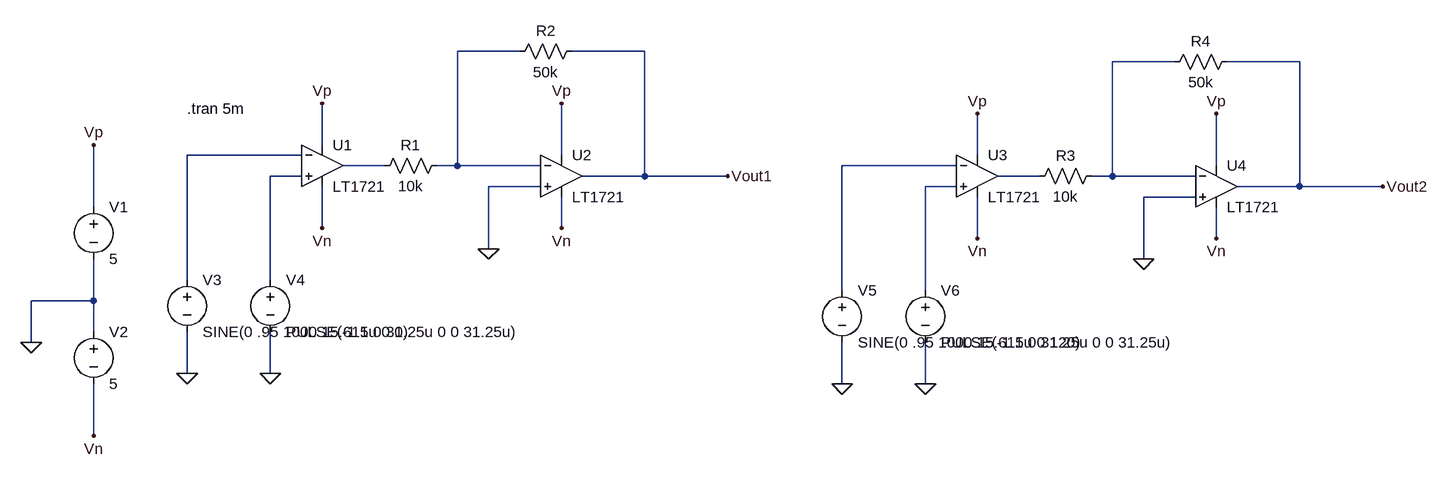
[diagram p0: schematic SPWM Experiment.asc]
SPWM Experiment.asc, the LTspice schematic file:
Version 4
SHEET 1 2196 680
WIRE 784 -176 688 -176
WIRE 976 -176 864 -176
WIRE 1792 -160 1696 -160
WIRE 1984 -160 1872 -160
WIRE 480 -32 480 -96
WIRE 448 -16 272 -16
WIRE 848 -16 848 -96
WIRE 1488 -16 1488 -80
WIRE 576 0 512 0
WIRE 688 0 688 -176
WIRE 688 0 656 0
WIRE 816 0 688 0
WIRE 1456 0 1280 0
WIRE 1856 0 1856 -80
WIRE 448 16 400 16
WIRE 976 16 976 -176
WIRE 976 16 880 16
WIRE 1104 16 976 16
WIRE 1584 16 1520 16
WIRE 1696 16 1696 -160
WIRE 1696 16 1664 16
WIRE 1824 16 1696 16
WIRE 816 32 736 32
WIRE 1456 32 1408 32
WIRE 1984 32 1984 -160
WIRE 1984 32 1888 32
WIRE 2112 32 1984 32
WIRE 1824 48 1744 48
WIRE 128 64 128 -32
WIRE 480 96 480 32
WIRE 848 96 848 48
WIRE 1488 112 1488 48
WIRE 1856 112 1856 64
WIRE 736 128 736 32
WIRE 1744 144 1744 48
WIRE 272 176 272 -16
WIRE 400 176 400 16
WIRE 1280 192 1280 0
WIRE 1408 192 1408 32
WIRE 128 208 128 144
WIRE 128 208 32 208
WIRE 128 256 128 208
WIRE 32 272 32 208
WIRE 272 320 272 256
WIRE 400 320 400 256
WIRE 1280 336 1280 272
WIRE 1408 336 1408 272
WIRE 128 416 128 336
FLAG 32 272 0
FLAG 128 -32 Vp
FLAG 128 416 Vn
FLAG 272 320 0
FLAG 400 320 0
FLAG 480 -96 Vp
FLAG 480 96 Vn
FLAG 848 -96 Vp
FLAG 848 96 Vn
FLAG 1104 16 Vout1
FLAG 736 128 0
FLAG 1280 336 0
FLAG 1408 336 0
FLAG 1488 -80 Vp
FLAG 1488 112 Vn
FLAG 1856 -80 Vp
FLAG 1856 112 Vn
FLAG 2112 32 Vout2
FLAG 1744 144 0
SYMBOL voltage 128 48 R0
WINDOW 123 0 0 Left 0
WINDOW 39 0 0 Left 0
SYMATTR InstName V1
SYMATTR Value 5
SYMBOL voltage 128 240 R0
WINDOW 123 0 0 Left 0
WINDOW 39 0 0 Left 0
SYMATTR InstName V2
SYMATTR Value 5
SYMBOL Comparators\\LT1721 480 -64 R0
SYMATTR InstName U1
SYMBOL Comparators\\LT1721 848 -48 R0
SYMATTR InstName U2
SYMBOL voltage 272 160 R0
WINDOW 123 0 0 Left 0
WINDOW 39 0 0 Left 0
SYMATTR InstName V3
SYMATTR Value SINE(0 .95 1000 15.615u 0 0)
SYMBOL voltage 400 160 R0
WINDOW 123 0 0 Left 0
WINDOW 39 0 0 Left 0
SYMATTR InstName V4
SYMATTR Value PULSE(-1 1 0 31.25u 0 0 31.25u)
SYMBOL res 672 -16 R90
WINDOW 0 0 56 VBottom 2
WINDOW 3 32 56 VTop 2
SYMATTR InstName R1
SYMATTR Value 10k
SYMBOL res 880 -192 R90
WINDOW 0 0 56 VBottom 2
WINDOW 3 32 56 VTop 2
SYMATTR InstName R2
SYMATTR Value 50k
SYMBOL Comparators\\LT1721 1488 -48 R0
SYMATTR InstName U3
SYMBOL Comparators\\LT1721 1856 -32 R0
SYMATTR InstName U4
SYMBOL voltage 1280 176 R0
WINDOW 123 0 0 Left 0
WINDOW 39 0 0 Left 0
SYMATTR InstName V5
SYMATTR Value SINE(0 .95 1000 15.615u 0 120)
SYMBOL voltage 1408 176 R0
WINDOW 123 0 0 Left 0
WINDOW 39 0 0 Left 0
SYMATTR InstName V6
SYMATTR Value PULSE(-1 1 0 31.25u 0 0 31.25u)
SYMBOL res 1680 0 R90
WINDOW 0 0 56 VBottom 2
WINDOW 3 32 56 VTop 2
SYMATTR InstName R3
SYMATTR Value 10k
SYMBOL res 1888 -176 R90
WINDOW 0 0 56 VBottom 2
WINDOW 3 32 56 VTop 2
SYMATTR InstName R4
SYMATTR Value 50k
TEXT 272 -88 Left 2 !.tran 5m

The netlist it stands for:
* SPWM Experiment.asc
V1 Vp 0 5
V2 0 Vn 5
XU1 N006 N003 Vp Vn N004 LT1720  ; LT1721, pins In+ In- V+ V- OUT
XU2 0 N001 Vp Vn Vout1 LT1720  ; LT1721, pins In+ In- V+ V- OUT
V3 N003 0 SINE(0 .95 1000 15.615u 0 0)
V4 N006 0 PULSE(-1 1 0 31.25u 0 0 31.25u)
R1 N001 N004 10k
R2 Vout1 N001 50k
XU3 N008 N005 Vp Vn N007 LT1720  ; LT1721, pins In+ In- V+ V- OUT
XU4 0 N002 Vp Vn Vout2 LT1720  ; LT1721, pins In+ In- V+ V- OUT
V5 N005 0 SINE(0 .95 1000 15.615u 0 120)
V6 N008 0 PULSE(-1 1 0 31.25u 0 0 31.25u)
R3 N002 N007 10k
R4 Vout2 N002 50k
.tran 5m
.lib LTC.lib
.backanno
.end